# EAGLE schematic 549-teletouch copy (EAGLE 8.0.0)
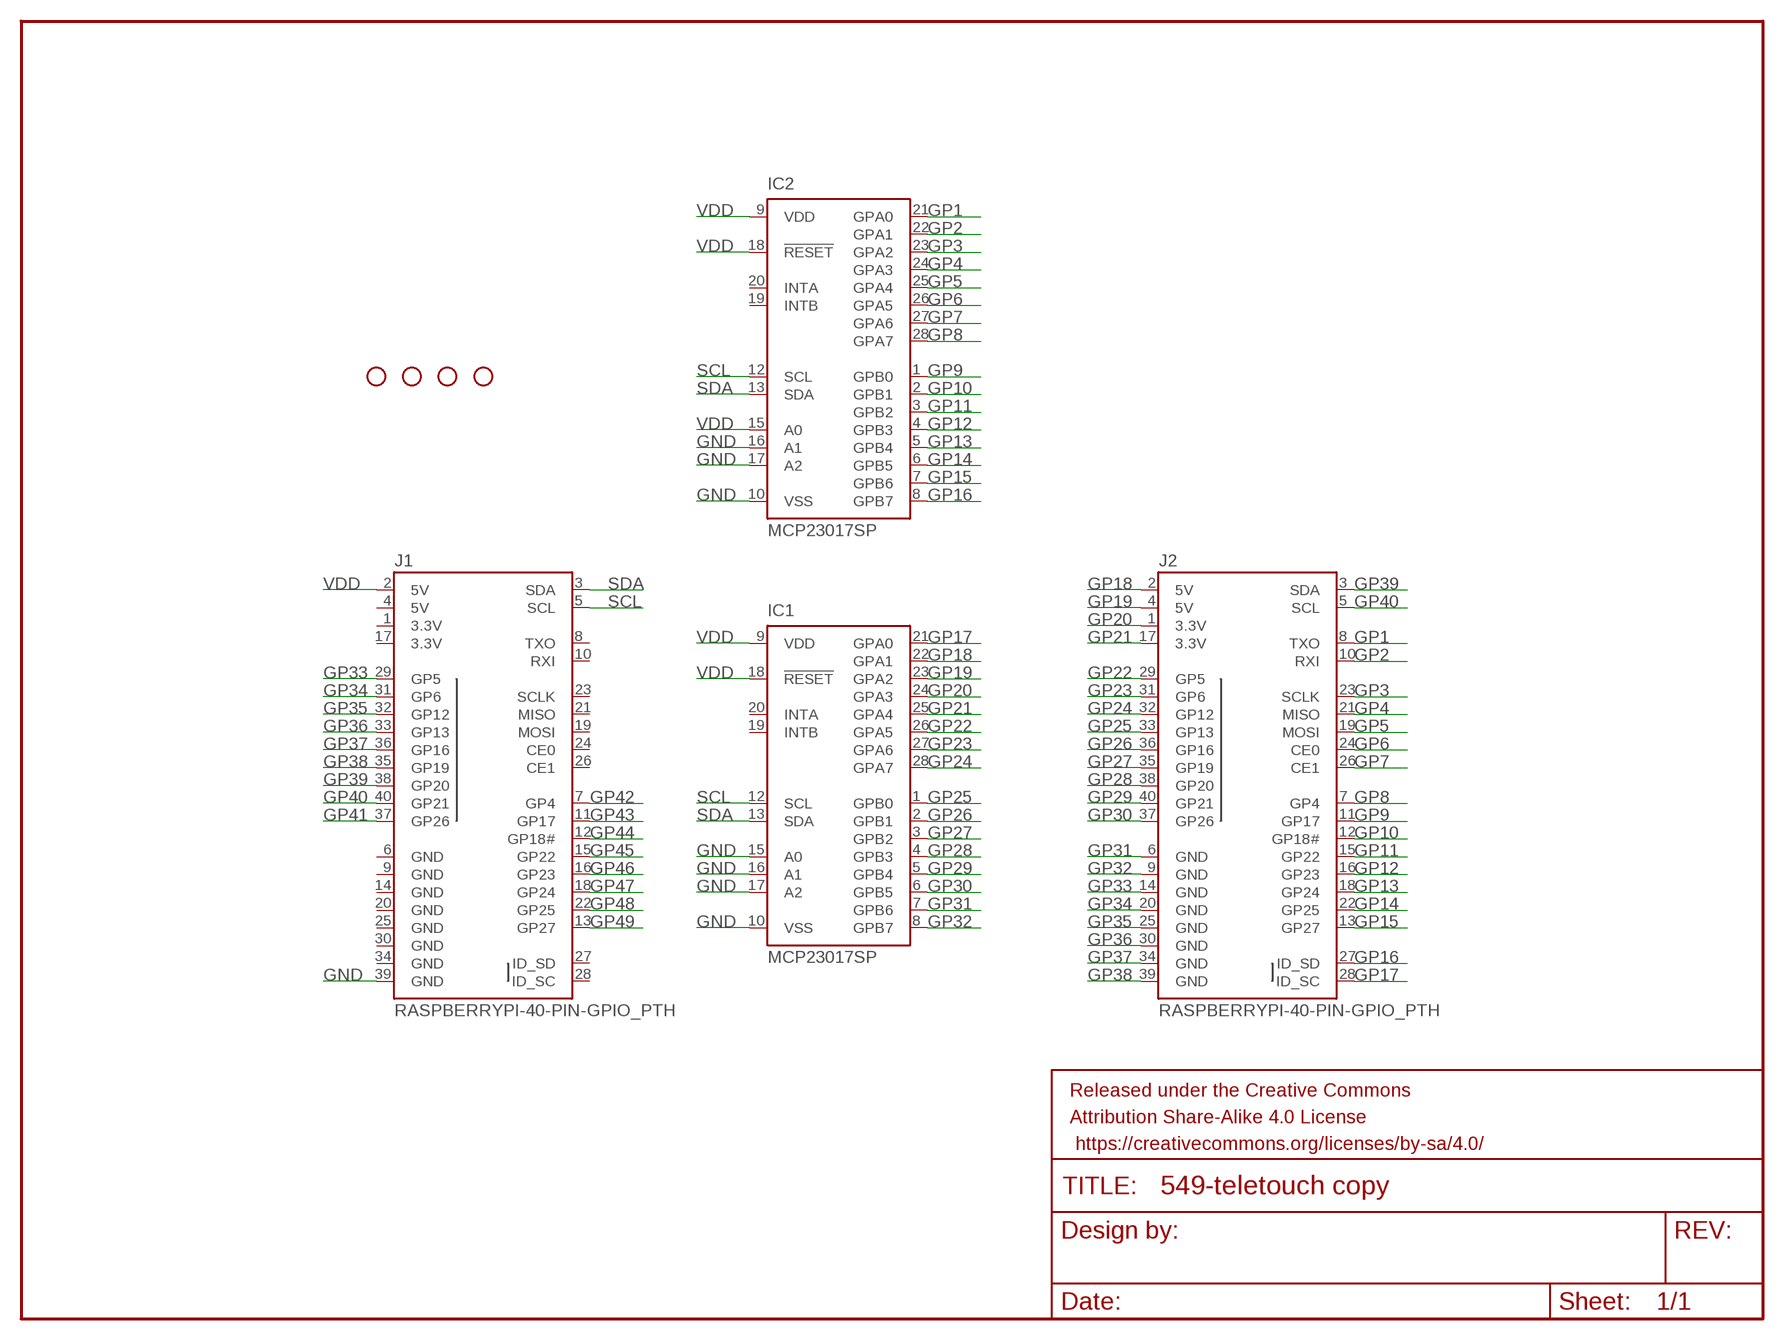
[diagram p0: schematic, sheet 1]

## Parts
FRAME1  FRAME-LETTER  [CREATIVE_COMMONS]
H1  STAND-OFF  [STAND-OFF]
H2  STAND-OFF  [STAND-OFF]
H3  STAND-OFF  [STAND-OFF]
H4  STAND-OFF  [STAND-OFF]
IC1  MCP23017SP  [DIL28-3]
IC2  MCP23017SP  [DIL28-3]
J1  RASPBERRYPI-40-PIN-GPIO_PTH  [2X20_SHROUDED]
J2  RASPBERRYPI-40-PIN-GPIO_PTH  [2X20_SHROUDED]

## Nets
GND: IC1.10(VSS) IC1.15(A0) IC1.16(A1) IC1.17(A2) IC2.10(VSS) IC2.16(A1) IC2.17(A2) J1.39(GND)
GP1: IC2.21(GPA0) J2.8(TXO)
GP2: IC2.22(GPA1) J2.10(RXI)
GP3: IC2.23(GPA2) J2.23(SCLK)
GP4: IC2.24(GPA3) J2.21(MISO)
GP5: IC2.25(GPA4) J2.19(MOSI)
GP6: IC2.26(GPA5) J2.24(CE0)
GP7: IC2.27(GPA6) J2.26(CE1)
GP8: IC2.28(GPA7) J2.7(GP4)
GP9: IC2.1(GPB0) J2.11(GP17)
GP10: IC2.2(GPB1) J2.12(GP18#)
GP11: IC2.3(GPB2) J2.15(GP22)
GP12: IC2.4(GPB3) J2.16(GP23)
GP13: IC2.5(GPB4) J2.18(GP24)
GP14: IC2.6(GPB5) J2.22(GP25)
GP15: IC2.7(GPB6) J2.13(GP27)
GP16: IC2.8(GPB7) J2.27(ID_SD)
GP17: IC1.21(GPA0) J2.28(ID_SC)
GP18: IC1.22(GPA1) J2.2(5V)
GP19: IC1.23(GPA2) J2.4(5V)
GP20: IC1.24(GPA3) J2.1(3.3V)
GP21: IC1.25(GPA4) J2.17(3.3V)
GP22: IC1.26(GPA5) J2.29(GP5)
GP23: IC1.27(GPA6) J2.31(GP6)
GP24: IC1.28(GPA7) J2.32(GP12)
GP25: IC1.1(GPB0) J2.33(GP13)
GP26: IC1.2(GPB1) J2.36(GP16)
GP27: IC1.3(GPB2) J2.35(GP19)
GP28: IC1.4(GPB3) J2.38(GP20)
GP29: IC1.5(GPB4) J2.40(GP21)
GP30: IC1.6(GPB5) J2.37(GP26)
GP31: IC1.7(GPB6) J2.6(GND)
GP32: IC1.8(GPB7) J2.9(GND)
GP33: J1.29(GP5) J2.14(GND)
GP34: J1.31(GP6) J2.20(GND)
GP35: J1.32(GP12) J2.25(GND)
GP36: J1.33(GP13) J2.30(GND)
GP37: J1.36(GP16) J2.34(GND)
GP38: J1.35(GP19) J2.39(GND)
GP39: J1.38(GP20) J2.3(SDA)
GP40: J1.40(GP21) J2.5(SCL)
GP41: J1.37(GP26)
GP42: J1.7(GP4)
GP43: J1.11(GP17)
GP44: J1.12(GP18#)
GP45: J1.15(GP22)
GP46: J1.16(GP23)
GP47: J1.18(GP24)
GP48: J1.22(GP25)
GP49: J1.13(GP27)
SCL: IC1.12(SCL) IC2.12(SCL) J1.5(SCL)
SDA: IC1.13(SDA) IC2.13(SDA) J1.3(SDA)
VDD: IC1.9(VDD) IC1.18(!RESET) IC2.9(VDD) IC2.15(A0) IC2.18(!RESET) J1.2(5V)
Unconnected: IC1.19(INTB) IC1.20(INTA) IC2.19(INTB) IC2.20(INTA) J1.8(TXO) J1.10(RXI) J1.19(MOSI) J1.21(MISO) J1.23(SCLK) J1.24(CE0) J1.26(CE1) J1.27(ID_SD) J1.28(ID_SC)

## Power pins joined to a net without a drawn wire
3.3V: J1.1(3.3V) J1.17(3.3V)
5V: J1.4(5V)
GND: J1.6(GND) J1.9(GND) J1.14(GND) J1.20(GND) J1.25(GND) J1.30(GND) J1.34(GND)

## Library data of the parts
FRAME1 = SparkFun-Aesthetics:FRAME-LETTER: Schematic Frame - Letter Standard 8.5x11 US Letter frame
H1-H4 = SparkFun-Hardware:STAND-OFF: Stand Off Drill holes for mechanically mounting via screws, standoffs, etc. Note: Use the keepout ring to avoid running the screw head into surrounding components. Variant Overviews STAND-OFF - Mechanical footprint for a #4 phillips button head screw. STAND-OFF-TIGHT - Mechanical footprint for a #4 phillips button head screw, Example SparkFun Products Screw - Phillips Head (1/4", 4-40, 10 pack) <https://www.sparkfun.com/products/10453> (PRT-10453) Screw - Phillips Head (1/2", 4-40, 10 pack) <https://www.sparkfun.com/products/10452> (PRT-10452) Screw - Phillips Head (3/4", 4-40, 10 pack) <https://www.sparkfun.com/products/10451> (PRT-10451) Screw - Phillips Head (1", 4-40, 10 pack) <https://www.sparkfun.com/products/10450> (PRT-10450)
IC1 IC2 = microchip:MCP23017: http://ww1.microchip.com/downloads/en/DeviceDoc/21952a.pdf Source: http://ww1.microchip.com/downloads/en/DeviceDoc/21952a.pdf; MF: MICROCHIP; MPN: MCP23017-E/SP; OC_FARNELL: 1332088; OC_NEWARK: 31K2959
J1 J2 = SparkFun-Connectors:RASPBERRYPI-40-PIN-GPIO: Raspberry Pi GPIO Header 2x20 pin connector, as found on B, B+, A+ models. Both shrouded PTH and SMT versions available. SparkFun Products: GPIO Shrouded Header <https://www.sparkfun.com/products/13054>- PTH SparkFun Pi Wedge (Preassembled) <https://www.sparkfun.com/products/13717>; PROD_ID: CONN-12263; SF_ID: PRT-13054